# Altium project DVT-HPF-100kHz.PrjPcb
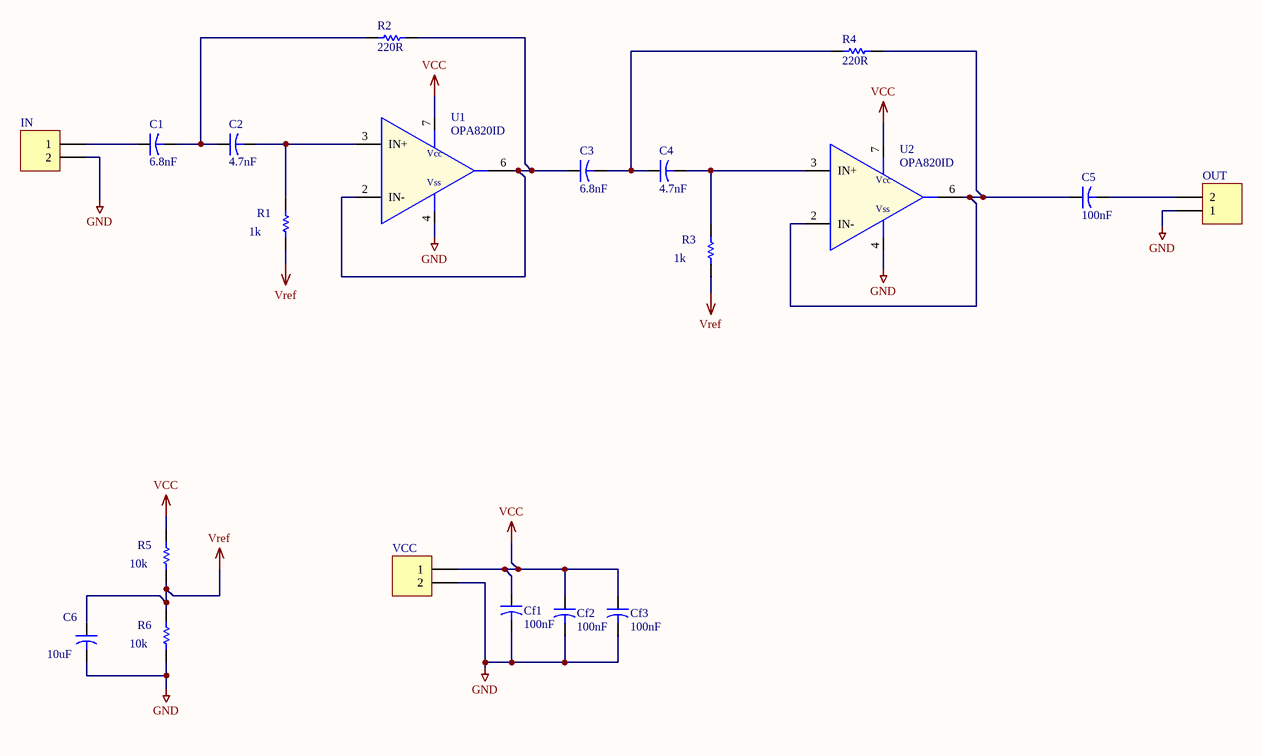
[diagram p0: DVT-HPF-100kHz.SchDoc]
1 sheet, 21 parts. Net scope: global (net labels, ports and power ports of the same name join across sheets).
Board file: DVT-HPF-100kHz.PcbDoc

## Sheet DVT-HPF-100kHz.SchDoc: DVT HPF 100kHz
size A4; Revision: 1; SheetNumber: 1; SheetTotal: 1; PartNumber: PN10045; Drawn By: Sebastian Kulik

### Parts
*  Om  [Om-5mm]  (value not drawn)
C1  value 6.8nF  [Dummy-10mm]  (hidden comment: Capacitor-Dummy-THT)
C2  value 4.7nF  [Dummy-10mm]  (hidden comment: Capacitor-Dummy-THT)
C3  value 6.8nF  [Dummy-10mm]  (hidden comment: Capacitor-Dummy-THT)
C4  value 4.7nF  [Dummy-10mm]  (hidden comment: Capacitor-Dummy-THT)
C5  value 100nF  [Dummy-10mm]  (hidden comment: Capacitor-Dummy-THT)
C6  value 10uF  [Dummy-10mm]  (hidden comment: Capacitor-Dummy-THT)
Cf1  value 100nF  [Dummy-10mm]  (hidden comment: Capacitor-Dummy-THT)
Cf2  value 100nF  [Dummy-10mm]  (hidden comment: Capacitor-Dummy-THT)
Cf3  value 100nF  [Dummy-10mm]  (hidden comment: Capacitor-Dummy-THT)
IN  PHOENIX_1715721  [Phoenix-2-5_08]  (value not drawn)
OUT  PHOENIX_1715721  [Phoenix-2-5_08]  (value not drawn)
R1  value 1k  [Dummy-10mm]  (hidden comment: Resistor-Dummy-THT)
R2  value 220R  [Dummy-10mm]  (hidden comment: Resistor-Dummy-THT)
R3  value 1k  [Dummy-10mm]  (hidden comment: Resistor-Dummy-THT)
R4  value 220R  [Dummy-10mm]  (hidden comment: Resistor-Dummy-THT)
R5  value 10k  [Dummy-10mm]  (hidden comment: Resistor-Dummy-THT)
R6  value 10k  [Dummy-10mm]  (hidden comment: Resistor-Dummy-THT)
U1  OPA820ID  [SOP8_L]
U2  OPA820ID  [SOP8_L]
VCC  PHOENIX_1715721  [Phoenix-2-5_08]  (value not drawn)

### Nets
GND: C6.2 Cf1.2 Cf2.2 Cf3.2 IN.2 OUT.1 R6.1 U1.4(Vss) U2.4(Vss) VCC.2
VCC: Cf1.1 Cf2.1 Cf3.1 R5.2 U1.7(Vcc) U2.7(Vcc) VCC.1
Vref: C6.1 R1.1 R3.1 R5.1 R6.2
NetC1_1: C1.1 IN.1
NetC1_2: C1.2 C2.1 R2.2
NetC2_2: C2.2 R1.2 U1.3(IN+)
NetC3_1: C3.1 R2.1 U1.2(IN-) U1.6(OUT)
NetC3_2: C3.2 C4.1 R4.2
NetC4_2: C4.2 R3.2 U2.3(IN+)
NetC5_1: C5.1 R4.1 U2.2(IN-) U2.6(OUT)
NetC5_2: C5.2 OUT.2

### Notes on the sheet
- Title
- Date
- Part Number
- Revision
- Sheet
- of
- Drawn By
- File

### Library data of the parts
C1 C3 = Capacitor-Dummy-THT: Deliverer PartNr: 699-5092; Deliverer: RS; Published: 08.12.2015; Part Description: Capacitor-Dummy-THT; Publisher: Sebastian Kulik; PackageDescription: -; Manufacturer: -; Manufacturer PartNr: -; TDE-PN: -; Price: 0.352/25
C2 C4 = Capacitor-Dummy-THT: Deliverer PartNr: 699-4894; Deliverer: RS; Published: 08.12.2015; Part Description: Capacitor-Dummy-THT; Publisher: Sebastian Kulik; PackageDescription: -; Manufacturer: -; Manufacturer PartNr: -; TDE-PN: -; Price: 0.196/5
C5 = Capacitor-Dummy-THT: Deliverer PartNr: 538-1310; Deliverer: RS; Published: 08.12.2015; Part Description: Capacitor-Dummy-THT; Publisher: Sebastian Kulik; PackageDescription: -; Manufacturer: -; Manufacturer PartNr: -; TDE-PN: -; Price: 0.116/5
C6 = Capacitor-Dummy-THT: Deliverer PartNr: 117-035; Deliverer: RS; Published: 08.12.2015; Part Description: Capacitor-Dummy-THT; Publisher: Sebastian Kulik; PackageDescription: -; Manufacturer: -; Manufacturer PartNr: -; TDE-PN: -; Price: 0.144/5
Cf1-Cf3 = Capacitor-Dummy-THT: Deliverer PartNr: 537-3707; Deliverer: RS; Published: 08.12.2015; Part Description: Capacitor-Dummy-THT; Publisher: Sebastian Kulik; PackageDescription: -; Manufacturer: -; Manufacturer PartNr: -; TDE-PN: -; Price: 0.156/25
IN OUT VCC = 2Pol_1715721: Phoenix, 2 pol, 5.08mm, 22A, 715721; Deliverer PartNr: 193-0564; Deliverer: RS; TDE-PN: CON0008; LatestRevisionDate: 02.05.2014; LatestRevisionNote: Re-released for DXP Platform.; Publisher: Sebastian Kulik; Manufacturer PartNr: 1715721; Manufacturer: Phoenix; PackageDescription: Phoenix-2-5_08
  IN OUT: Price: 0.976/5
R1 R3 = Resistor-Dummy-THT: Deliverer PartNr: 148-506; Deliverer: RS; Published: 08.12.2015; Publisher: Sebastian Kulik; PackageDescription: -; Manufacturer: -; Manufacturer PartNr: -; TDE-PN: -; Part Desicription: Resistor-Dummy-THT; Price: 0.027/10
R2 R4 = Resistor-Dummy-THT: Deliverer PartNr: 148-348; Deliverer: RS; Published: 08.12.2015; Publisher: Sebastian Kulik; PackageDescription: -; Manufacturer: -; Manufacturer PartNr: -; TDE-PN: -; Part Desicription: Resistor-Dummy-THT; Price: 0.046/10
R5 R6 = Resistor-Dummy-THT: Deliverer PartNr: 148-736; Deliverer: RS; Published: 08.12.2015; Publisher: Sebastian Kulik; PackageDescription: -; Manufacturer: -; Manufacturer PartNr: -; TDE-PN: -; Part Desicription: Resistor-Dummy-THT; Price: 0.027/10
U1 U2 = OPA820ID: High speed OP, 260MHz; Deliverer PartNr: 661-1053; Manufacturer: TI; Deliverer: RS; TDE-PN: IC00077; Published: 31.05.2016; PackageDescription: TSSOP8; Publisher: Sebastian Kulik; Manufacturer PartNr: OPA820ID; Price: 2.548/5